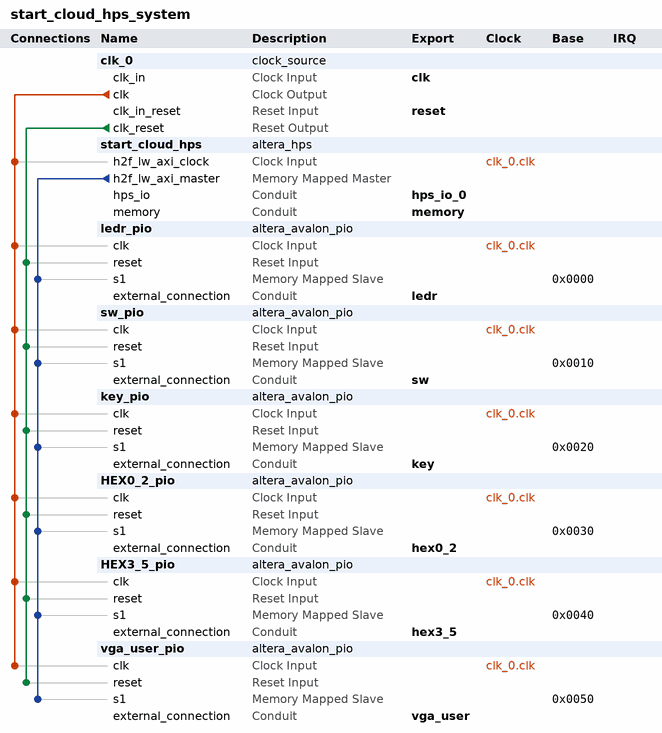
[diagram p0: system contents]
# Platform Designer (Qsys) system start_cloud_hps_system, Cyclone V 5CSEMA5F31C6
# Parameters at their usual value, and those the tool derives, are not listed.
package require -exact qsys 18.0
create_system start_cloud_hps_system
set_project_property DEVICE_FAMILY {Cyclone V}
set_project_property DEVICE 5CSEMA5F31C6

add_instance clk_0 clock_source 18.0
set_instance_parameter_value clk_0 clockFrequency 50000000

add_instance start_cloud_hps altera_hps 18.0
set_instance_parameter_value start_cloud_hps EMAC1_Mode N/A
set_instance_parameter_value start_cloud_hps EMAC1_PinMuxing Unused
set_instance_parameter_value start_cloud_hps F2SCLK_COLDRST_Enable false
set_instance_parameter_value start_cloud_hps F2SCLK_DBGRST_Enable false
set_instance_parameter_value start_cloud_hps F2SCLK_WARMRST_Enable false
set_instance_parameter_value start_cloud_hps F2SINTERRUPT_Enable false
set_instance_parameter_value start_cloud_hps F2S_Width 0
set_instance_parameter_value start_cloud_hps FPGA_PERIPHERAL_OUTPUT_CLOCK_FREQ_EMAC0_GTX_CLK 125
set_instance_parameter_value start_cloud_hps FPGA_PERIPHERAL_OUTPUT_CLOCK_FREQ_EMAC0_MD_CLK 2.5
set_instance_parameter_value start_cloud_hps FPGA_PERIPHERAL_OUTPUT_CLOCK_FREQ_EMAC1_GTX_CLK 125
set_instance_parameter_value start_cloud_hps FPGA_PERIPHERAL_OUTPUT_CLOCK_FREQ_EMAC1_MD_CLK 2.5
set_instance_parameter_value start_cloud_hps HPS_PROTOCOL DDR3
set_instance_parameter_value start_cloud_hps I2C0_Mode N/A
set_instance_parameter_value start_cloud_hps I2C0_PinMuxing Unused
set_instance_parameter_value start_cloud_hps I2C1_Mode N/A
set_instance_parameter_value start_cloud_hps I2C1_PinMuxing Unused
set_instance_parameter_value start_cloud_hps LWH2F_Enable true
set_instance_parameter_value start_cloud_hps MEM_BANKADDR_WIDTH 3
set_instance_parameter_value start_cloud_hps MEM_CLK_FREQ 300.0
set_instance_parameter_value start_cloud_hps MEM_CLK_FREQ_MAX 400.0
set_instance_parameter_value start_cloud_hps MEM_COL_ADDR_WIDTH 8
set_instance_parameter_value start_cloud_hps MEM_DQ_WIDTH 8
set_instance_parameter_value start_cloud_hps MEM_DRV_STR RZQ/6
set_instance_parameter_value start_cloud_hps MEM_ROW_ADDR_WIDTH 12
set_instance_parameter_value start_cloud_hps MEM_RTT_NOM {ODT Disabled}
set_instance_parameter_value start_cloud_hps MEM_RTT_WR {Dynamic ODT off}
set_instance_parameter_value start_cloud_hps MEM_TCL 7
set_instance_parameter_value start_cloud_hps MEM_TFAW_NS 37.5
set_instance_parameter_value start_cloud_hps MEM_TINIT_US 499
set_instance_parameter_value start_cloud_hps MEM_TMRD_CK 3
set_instance_parameter_value start_cloud_hps MEM_TRAS_NS 40.0
set_instance_parameter_value start_cloud_hps MEM_TRCD_NS 15.0
set_instance_parameter_value start_cloud_hps MEM_TREFI_US 7.0
set_instance_parameter_value start_cloud_hps MEM_TRFC_NS 75.0
set_instance_parameter_value start_cloud_hps MEM_TRP_NS 15.0
set_instance_parameter_value start_cloud_hps MEM_TWTR 2
set_instance_parameter_value start_cloud_hps MEM_VENDOR JEDEC
set_instance_parameter_value start_cloud_hps MEM_WTCL 6
set_instance_parameter_value start_cloud_hps QSPI_Mode N/A
set_instance_parameter_value start_cloud_hps QSPI_PinMuxing Unused
set_instance_parameter_value start_cloud_hps REF_CLK_FREQ 125.0
set_instance_parameter_value start_cloud_hps S2FCLK_USER2CLK 5
set_instance_parameter_value start_cloud_hps S2F_Width 0
set_instance_parameter_value start_cloud_hps SDIO_Mode {4-bit Data}
set_instance_parameter_value start_cloud_hps SDIO_PinMuxing {HPS I/O Set 0}
set_instance_parameter_value start_cloud_hps SPIM1_Mode N/A
set_instance_parameter_value start_cloud_hps SPIM1_PinMuxing Unused
set_instance_parameter_value start_cloud_hps STM_Enable false
set_instance_parameter_value start_cloud_hps TIMING_BOARD_AC_SKEW 0.02
set_instance_parameter_value start_cloud_hps TIMING_BOARD_AC_TO_CK_SKEW 0.0
set_instance_parameter_value start_cloud_hps TIMING_BOARD_DQ_TO_DQS_SKEW 0.0
set_instance_parameter_value start_cloud_hps TIMING_BOARD_MAX_CK_DELAY 0.6
set_instance_parameter_value start_cloud_hps TIMING_BOARD_MAX_DQS_DELAY 0.6
set_instance_parameter_value start_cloud_hps TIMING_BOARD_SKEW_BETWEEN_DQS 0.02
set_instance_parameter_value start_cloud_hps TIMING_BOARD_SKEW_CKDQS_DIMM_MAX 0.01
set_instance_parameter_value start_cloud_hps TIMING_BOARD_SKEW_CKDQS_DIMM_MIN -0.01
set_instance_parameter_value start_cloud_hps TIMING_BOARD_SKEW_WITHIN_DQS 0.02
set_instance_parameter_value start_cloud_hps TIMING_TDH 125
set_instance_parameter_value start_cloud_hps TIMING_TDQSCK 400
set_instance_parameter_value start_cloud_hps TIMING_TDQSQ 120
set_instance_parameter_value start_cloud_hps TIMING_TDS 50
set_instance_parameter_value start_cloud_hps TIMING_TIH 250
set_instance_parameter_value start_cloud_hps TIMING_TIS 175
set_instance_parameter_value start_cloud_hps TIMING_TQSH 0.38
set_instance_parameter_value start_cloud_hps UART0_Mode {No Flow Control}
set_instance_parameter_value start_cloud_hps UART0_PinMuxing {HPS I/O Set 0}
set_instance_parameter_value start_cloud_hps USB1_Mode N/A
set_instance_parameter_value start_cloud_hps USB1_PinMuxing Unused
set_instance_parameter_value start_cloud_hps desired_cfg_clk_mhz 100.0
set_instance_parameter_value start_cloud_hps desired_qspi_clk_mhz 370.0

add_instance ledr_pio altera_avalon_pio 18.0
set_instance_parameter_value ledr_pio direction Input
set_instance_parameter_value ledr_pio width 10

add_instance sw_pio altera_avalon_pio 18.0
set_instance_parameter_value sw_pio direction Output
set_instance_parameter_value sw_pio width 10

add_instance key_pio altera_avalon_pio 18.0
set_instance_parameter_value key_pio direction Output
set_instance_parameter_value key_pio width 4

add_instance HEX0_2_pio altera_avalon_pio 18.0
set_instance_parameter_value HEX0_2_pio direction Input
set_instance_parameter_value HEX0_2_pio width 21

add_instance HEX3_5_pio altera_avalon_pio 18.0
set_instance_parameter_value HEX3_5_pio direction Input
set_instance_parameter_value HEX3_5_pio width 21

add_instance vga_user_pio altera_avalon_pio 18.0
set_instance_parameter_value vga_user_pio direction Input
set_instance_parameter_value vga_user_pio width 22

# connections
add_connection clk_0.clk HEX0_2_pio.clk clock
add_connection clk_0.clk HEX3_5_pio.clk clock
add_connection clk_0.clk key_pio.clk clock
add_connection clk_0.clk ledr_pio.clk clock
add_connection clk_0.clk start_cloud_hps.h2f_lw_axi_clock clock
add_connection clk_0.clk sw_pio.clk clock
add_connection clk_0.clk vga_user_pio.clk clock
add_connection clk_0.clk_reset HEX0_2_pio.reset reset
add_connection clk_0.clk_reset HEX3_5_pio.reset reset
add_connection clk_0.clk_reset key_pio.reset reset
add_connection clk_0.clk_reset ledr_pio.reset reset
add_connection clk_0.clk_reset sw_pio.reset reset
add_connection clk_0.clk_reset vga_user_pio.reset reset
add_connection start_cloud_hps.h2f_lw_axi_master HEX0_2_pio.s1 avalon
set_connection_parameter_value start_cloud_hps.h2f_lw_axi_master/HEX0_2_pio.s1 baseAddress 0x0030
add_connection start_cloud_hps.h2f_lw_axi_master HEX3_5_pio.s1 avalon
set_connection_parameter_value start_cloud_hps.h2f_lw_axi_master/HEX3_5_pio.s1 baseAddress 0x0040
add_connection start_cloud_hps.h2f_lw_axi_master key_pio.s1 avalon
set_connection_parameter_value start_cloud_hps.h2f_lw_axi_master/key_pio.s1 baseAddress 0x0020
add_connection start_cloud_hps.h2f_lw_axi_master ledr_pio.s1 avalon
set_connection_parameter_value start_cloud_hps.h2f_lw_axi_master/ledr_pio.s1 baseAddress 0x0000
add_connection start_cloud_hps.h2f_lw_axi_master sw_pio.s1 avalon
set_connection_parameter_value start_cloud_hps.h2f_lw_axi_master/sw_pio.s1 baseAddress 0x0010
add_connection start_cloud_hps.h2f_lw_axi_master vga_user_pio.s1 avalon
set_connection_parameter_value start_cloud_hps.h2f_lw_axi_master/vga_user_pio.s1 baseAddress 0x0050

# exported interfaces
add_interface clk clock sink
set_interface_property clk EXPORT_OF clk_0.clk_in
add_interface hex0_2 conduit end
set_interface_property hex0_2 EXPORT_OF HEX0_2_pio.external_connection
add_interface hex3_5 conduit end
set_interface_property hex3_5 EXPORT_OF HEX3_5_pio.external_connection
add_interface hps_io_0 conduit end
set_interface_property hps_io_0 EXPORT_OF start_cloud_hps.hps_io
add_interface key conduit end
set_interface_property key EXPORT_OF key_pio.external_connection
add_interface ledr conduit end
set_interface_property ledr EXPORT_OF ledr_pio.external_connection
add_interface memory conduit end
set_interface_property memory EXPORT_OF start_cloud_hps.memory
add_interface reset reset sink
set_interface_property reset EXPORT_OF clk_0.clk_in_reset
add_interface sw conduit end
set_interface_property sw EXPORT_OF sw_pio.external_connection
add_interface vga_user conduit end
set_interface_property vga_user EXPORT_OF vga_user_pio.external_connection

set_interconnect_requirement {$system} qsys_mm.clockCrossingAdapter HANDSHAKE
set_interconnect_requirement {$system} qsys_mm.enableEccProtection FALSE
set_interconnect_requirement {$system} qsys_mm.insertDefaultSlave FALSE
set_interconnect_requirement {$system} qsys_mm.maxAdditionalLatency 1

save_system start_cloud_hps_system.qsys
